# EAGLE design led (EAGLE 9.2.0)
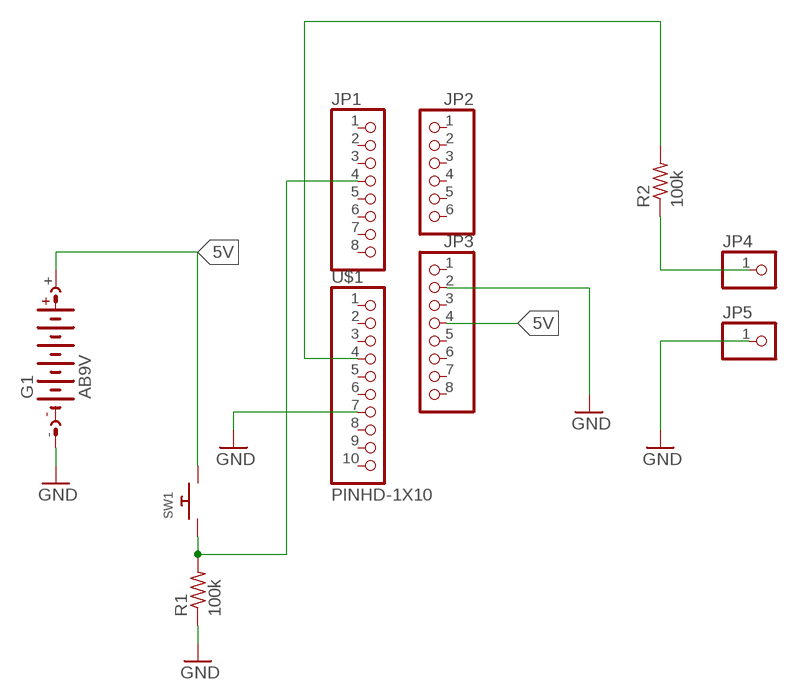
[diagram p0: schematic, sheet 1]

## Parts
G1  AB9V  [AB9V]
JP1  PINHD-1X8BIG  [1X08-BIG]
JP2  PINHD-1X6B  [1X06-BIG]
JP3  PINHD-1X8BIG  [1X08-BIG]
JP4  PINHD-1X1  [1X01]
JP5  PINHD-1X1  [1X01]
R1  100k  R-US_FLIPFLOP  [0805-THM]
R2  100k  R-US_FLIPFLOP  [0805-THM]
SW1  SWITCH_PUSHBUTTONSOFTTOUCHSMD_SJ  [PUSHBUTTON_SMD_SJ]
U$1  PINHD-1X10  [1X10-BIG]

## Nets
5V: G1.+ JP3.4 SW1.P$2
GND: G1.- JP3.2 JP5.1 R1.1 U$1.7
N$2: R2.2 U$1.4
N$3: JP4.1 R2.1
N$4: JP1.4 R1.2 SW1.P$1
Unconnected: JP1.1 JP1.2 JP1.3 JP1.5 JP1.6 JP1.7 JP1.8 JP2.1 JP2.2 JP2.3 JP2.4 JP2.5 JP2.6 JP3.1 JP3.3 JP3.5 JP3.6 JP3.7 JP3.8 U$1.1 U$1.2 U$1.3 U$1.5 U$1.6 U$1.8 U$1.9 U$1.10

## Library data of the parts
G1 = battery:AB9V: 9-V BATTERY CLIP
JP1 JP3 = adafruit:PINHD-1X8: PIN HEADER
JP2 = adafruit:PINHD-1X6: PIN HEADER
JP4 JP5 = adafruit:PINHD-1X1: Pin header 1x1 for 0.1" spacing With round pins
R1 R2 = adafruit:R-US_: RESISTOR, American symbol
SW1 = adafruit:SWITCH_PUSHBUTTON: Buttons SOFTTOUCHSMD_SJ - Soft touch temporary push button (Super Junk Akihabara) Compatible with SKPMANE010 [Mouser: 688-SKPMAN] C&K_KSS = Digikey: KSS221GLFS
U$1 = adafruit:PINHD-1X10: Pin header 1x10 0.1" spacing With round pins

## Board
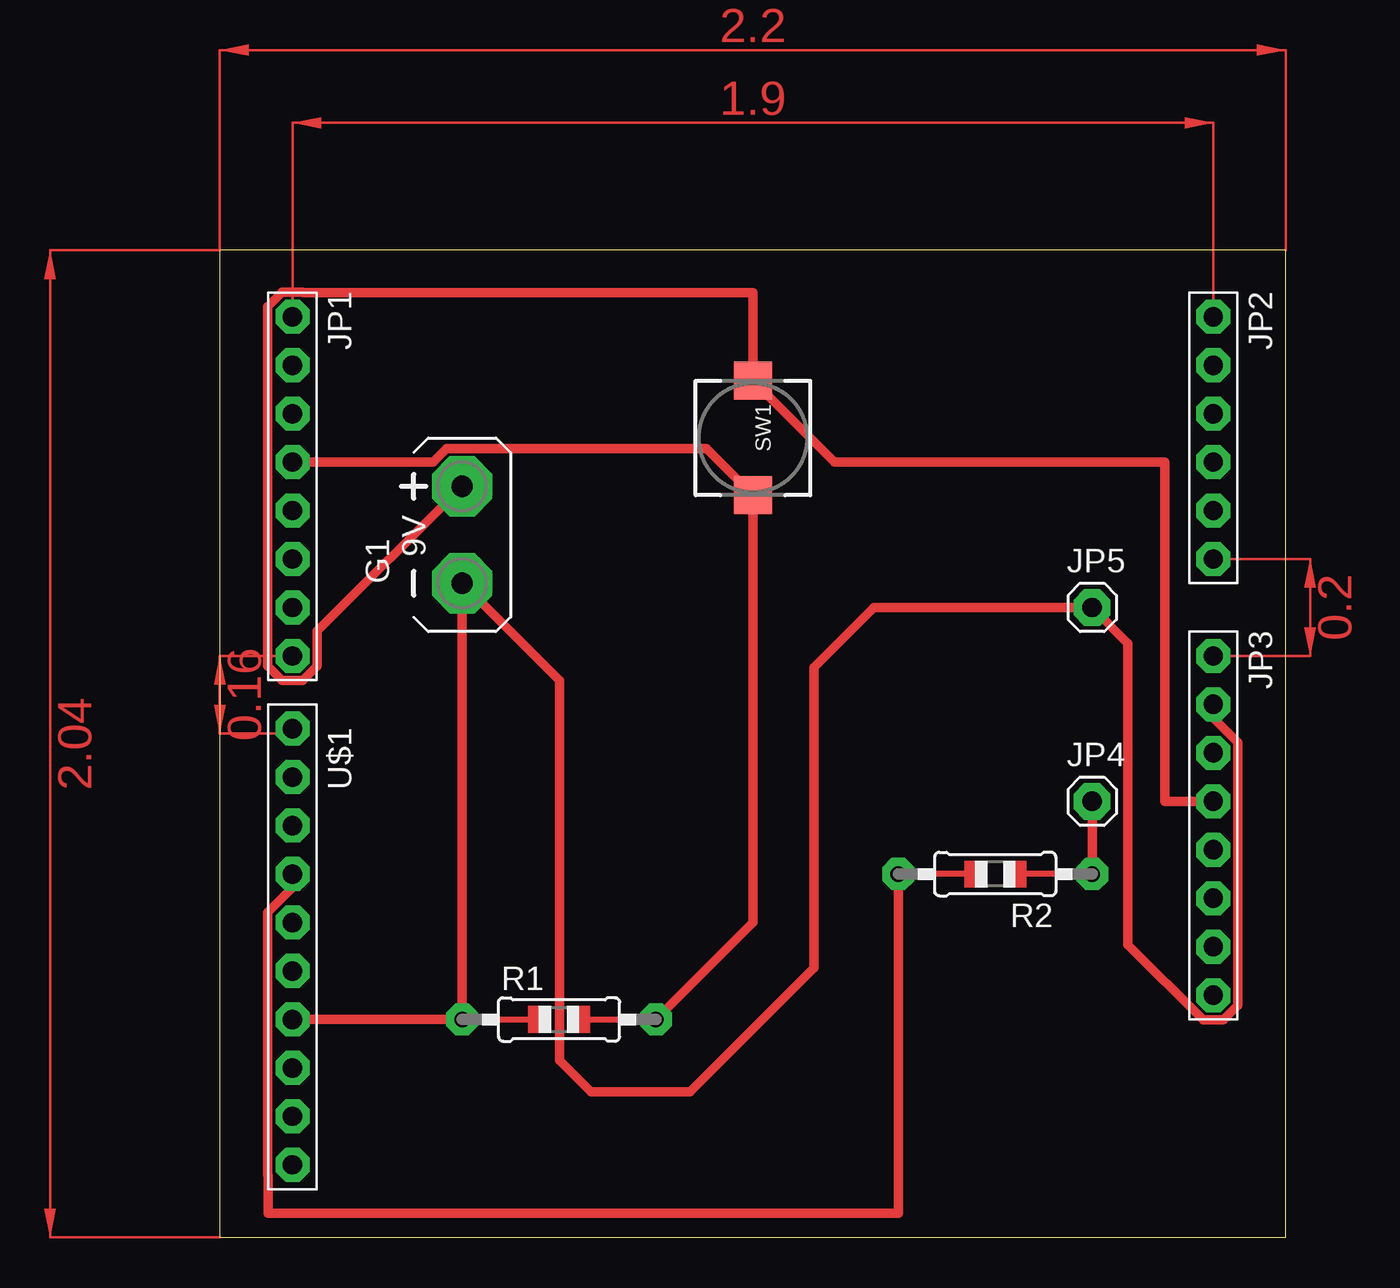
[diagram p1: board, top side]

Size 55.86 x 51.74 mm. Coordinates in mm from the lower left corner, seen from the top.
Outline: 0,0 55.86,0 55.86,51.74 0,51.74 0,0
Copper layers (1*16): Top 0.035mm / dielectric 1.5mm / Bottom 0.035mm
Design rules "default": minimum track width 6mil, minimum drill 0.35mm, track to track 6mil, track to pad 6mil, pad to pad 6mil, via to via 6mil, smd to smd 6mil, copper to edge 40mil, drill to drill 6mil, minimum pad ring 10mil, minimum via ring 8mil, stop-mask expansion 4mil, vias tented up to drill 0mil, thermal gap 10mil

### Footprints (pad centres in the part's own frame; a part is rotated, then mirrored left to right if it is on the bottom)
AB9V = drill 1.118 pad 3.15 octagon: + 0,2.54; - 0,-2.54
1X08-BIG = drill 1.016 pad 1.778 octagon: 1 -8.89,0; 2 -6.35,0; 3 -3.81,0; 4 -1.27,0; 5 1.27,0; 6 3.81,0; 7 6.35,0; 8 8.89,0
1X06-BIG = drill 1.016 pad 1.778 octagon: 1 -6.35,0; 2 -3.81,0; 3 -1.27,0; 4 1.27,0; 5 3.81,0; 6 6.35,0
1X01 = drill 1.016 pad 1.93 octagon: 1 0,0
0805-THM = drill 0.813 pad 1.676 octagon: 1 -5.08,0; 2 5.08,0
PUSHBUTTON_SMD_SJ = smd 2 x 2: P$1 3,0; P$2 -3,0
1X10-BIG = drill 1.016 pad 1.778 octagon: 1 -11.43,0; 2 -8.89,0; 3 -6.35,0; 4 -3.81,0; 5 -1.27,0; 6 1.27,0; 7 3.81,0; 8 6.35,0; 9 8.89,0; 10 11.43,0

### Placement (x,y rotation side)
G1  12.7,36.83 0 top
JP1  3.81,39.37 270 top
JP2  52.07,41.91 270 top
JP3  52.07,21.59 270 top
JP4  45.72,22.86 0 top
JP5  45.72,33.02 0 top
R1  17.78,11.43 0 top
R2  40.64,19.05 180 top
SW1  27.94,41.91 270 top
U$1  3.81,15.24 270 top

### Tracks (layer width: path | path; a pad name or v marks a point on that pad's centre or on a via)
5V
  Top 0.508: G1.+ 5.11,31.77 5.11,29.94 4.35,29.19 3.27,29.19 2.52,29.94 2.52,48.8 3.27,49.55 4.35,49.55 4.37,49.53 27.94,49.53 SW1.P$2 32.21,40.64 49.53,40.64 49.53,22.86 JP3.4
GND
  Top 0.508: U$1.7 R1.1 G1.- 17.8,29.19 17.8,9.29 19.45,7.64 24.65,7.64 31.14,14.14 31.14,29.87 34.29,33.02 JP5.1 47.6,31.14 47.6,15.34 51.53,11.41 52.61,11.41 53.37,12.16 53.37,25.94 52.07,27.23 JP3.2
N$2
  Top 0.508: U$1.4 3.81,18.34 2.52,17.05 2.52,3.27 2.54,3.25 2.54,1.27 35.56,1.27 35.56,15.24 R2.2
N$3
  Top 0.508: JP4.1 R2.1
N$4
  Top 0.508: R1.2 27.94,16.51 SW1.P$1 25.5,41.35 11.88,41.35 11.17,40.64 JP1.4
(copper drawn outside any net)
  shapes: Top area x5